# Altium project OrangePi4xProbes.PrjPcb
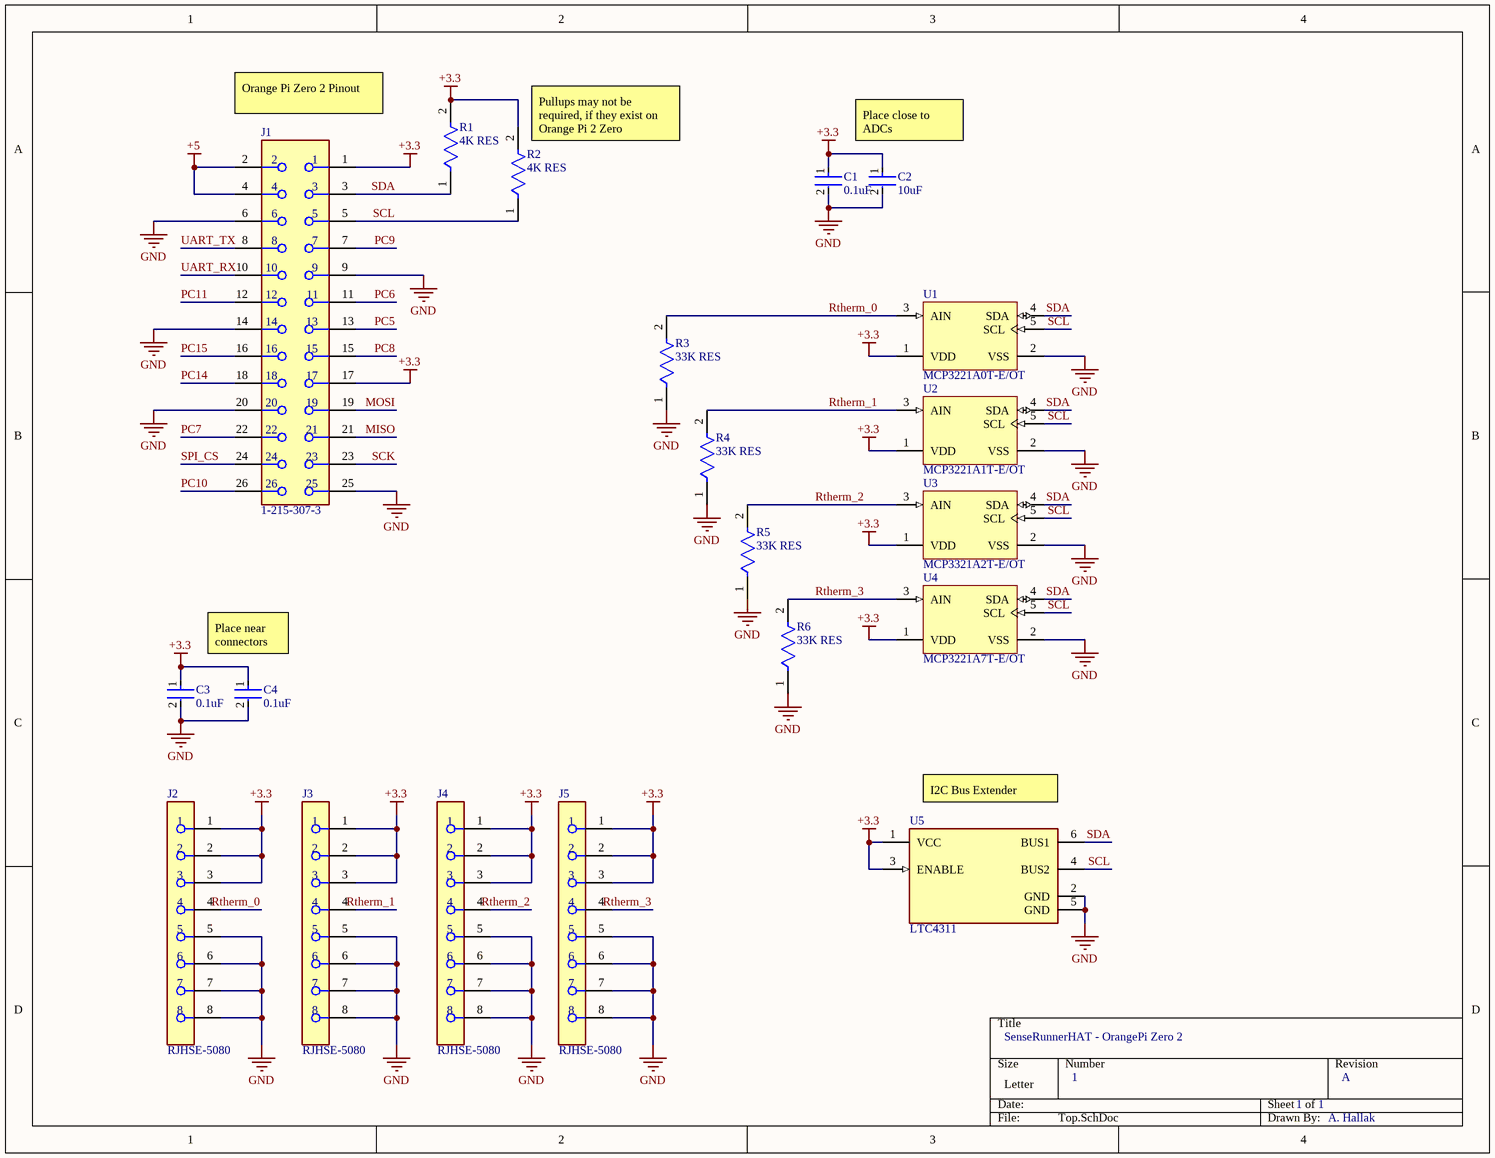
[diagram p0: Top.SchDoc]
1 sheet, 20 parts. Net scope: global (net labels, ports and power ports of the same name join across sheets).
Board file: Hat_Zero2SenseRunner.PcbDoc

## Sheet Top.SchDoc: SenseRunnerHat-OP
size Letter; Author: A. Hallak; SheetNumber: 1; SheetTotal: 1

### Parts
C1  0.1uF  [FP-DE6_D7_T7_F7_5_d0_6-0-MFG]
C2  10uF  [FP-DE6_D7_T7_F7_5_d0_6-0-MFG]
C3  0.1uF  [FP-DE6_D7_T7_F7_5_d0_6-0-MFG]
C4  0.1uF  [FP-DE6_D7_T7_F7_5_d0_6-0-MFG]
J1  1-215-307-3  [26PIN]
J2  RJHSE-5080  [FP-RJHSE-5080-MFG]
J3  RJHSE-5080  [FP-RJHSE-5080-MFG]
J4  RJHSE-5080  [FP-RJHSE-5080-MFG]
J5  RJHSE-5080  [FP-RJHSE-5080-MFG]
R1  4K RES  [FP-H8-MFG]
R2  4K RES  [FP-H8-MFG]
R3  33K RES  [FP-H8-MFG]
R4  33K RES  [FP-H8-MFG]
R5  33K RES  [FP-H8-MFG]
R6  33K RES  [FP-H8-MFG]
U1  MCP3221A0T-E/OT  [SOT-23-OT5_N]
U2  MCP3221A1T-E/OT  [SOT-23-OT5_N]
U3  MCP3321A2T-E/OT  [SOT-23-OT5_N]
U4  MCP3221A7T-E/OT  [SOT-23-OT5_N]
U5  LTC4311  [FP-SC6-6-05-08-1638-IPC_C]

### Nets
+3.3: C1.1 C2.1 C3.1 C4.1 J1.1 J1.17 J2.1 J2.2 J2.3 J3.1 J3.2 J3.3 J4.1 J4.2 J4.3 J5.1 J5.2 J5.3 R1.2 R2.2 U1.1(VDD) U2.1(VDD) U3.1(VDD) U4.1(VDD) U5.1(VCC) U5.3(ENABLE)
+5: J1.2 J1.4
GND: C1.2 C2.2 C3.2 C4.2 J1.6 J1.9 J1.14 J1.20 J1.25 J2.5 J2.6 J2.7 J2.8 J3.5 J3.6 J3.7 J3.8 J4.5 J4.6 J4.7 J4.8 J5.5 J5.6 J5.7 J5.8 R3.1 R4.1 R5.1 R6.1 U1.2(VSS) U2.2(VSS) U3.2(VSS) U4.2(VSS) U5.2(GND) U5.5(GND)
MISO: J1.21
MOSI: J1.19
PC5: J1.13
PC6: J1.11
PC7: J1.22
PC8: J1.15
PC9: J1.7
PC10: J1.26
PC11: J1.12
PC14: J1.18
PC15: J1.16
Rtherm_0: J2.4 R3.2 U1.3(AIN)
Rtherm_1: J3.4 R4.2 U2.3(AIN)
Rtherm_2: J4.4 R5.2 U3.3(AIN)
Rtherm_3: J5.4 R6.2 U4.3(AIN)
SCK: J1.23
SCL: J1.5 R2.1 U1.5(SCL) U2.5(SCL) U3.5(SCL) U4.5(SCL) U5.4(BUS2)
SDA: J1.3 R1.1 U1.4(SDA) U2.4(SDA) U3.4(SDA) U4.4(SDA) U5.6(BUS1)
SPI_CS: J1.24
UART_RX: J1.10
UART_TX: J1.8

### Notes on the sheet
- Orange Pi Zero 2 Pinout
- (near R2) Pullups may not be required, if they exist on Orange Pi 2 Zero
- Place close to ADCs
- Place near connectors
- (near U5) I2C Bus Extender
- SenseRunnerHAT - OrangePi Zero 2
- 1
- A
- A. Hallak

### Library data of the parts
C1 C3 C4 = CMP-06035-062244-1: CAP CER 0.1uF; Part Number: ANY 0.1uF CAP; Lead/Base Style: Formed Leads; Material: Ceramic; Tolerance: 20%; Lead Diameter: 0.6mm; Voltage Rating (AC): 300V; Termination: Radial; Width: 7mm; Package Quantity: 700; Lead Pitch: 7.5mm; Capacitance: 0.1uF; Case/Package: Radial; Resistor Type: Ceramic; Ratings: AEC-Q200; Series: KJ; Depth: 7mm; Min Operating Temperature: -25°C; Height - Seated (Max): 0.394inch; Mount: Through Hole; REACH SVHC: No SVHC; Max Operating Temperature: 125°C; Packaging: Bulk
C2 = CMP-06035-062244-1: CAP CER 10uF; Part Number: ANY 10uF CAP; Lead/Base Style: Formed Leads; Material: Ceramic; Tolerance: 20%; Lead Diameter: 0.6mm; Voltage Rating (AC): 300V; Termination: Radial; Width: 7mm; Package Quantity: 700; Lead Pitch: 7.5mm; Capacitance: 10uF; Case/Package: Radial; Resistor Type: Ceramic; Ratings: AEC-Q200; Series: KJ; Depth: 7mm; Min Operating Temperature: -25°C; Height - Seated (Max): 0.394inch; Mount: Through Hole; REACH SVHC: No SVHC; Max Operating Temperature: 125°C; Packaging: Bulk
J1 = CMP-25680-000025-1: CONN HDR 26POS; Pitch: 0.1inch; Number of Positions: 40; Connector Type: Header; Color: Black; Mount: Through Hole; Number of Rows: 2; Contact Plating: Gold; Packaging: Tray; Row Spacing: 0.1inch; Termination: Solder; Package Quantity: 1; Lead Free: Lead Free
J2-J5 = CMP-02366-000003-1: CONN MOD JACK 8P8C R/A UNSHLD; Manufacturer: Amphenol; Current Rating: 1.5A; Voltage Rating: 125V; Pitch: 1.02mm; Conn Orientation: Right Angle; Number Of Contacts: 8; Is Female: yes; Conn Gender: Female; Part Number: RJHSE-5080; Device Class L3: unset; Footprint Url: https://cdn.amphenol-icc.com/media/wysiwyg/files/drawing/rjhse5080.pdf?__cf_chl_jschl_tk__=e349db0bbbb6188a39347cd5e541b92fa02c9719-1587748343-0-AW7tChdeHzRPLX9gSWj7WrKaXQoY9BsmT9Ek0h-T62M9y3Rs9iypFcOtkzb-6sGYQEjFE-jcoNciDETCOZrh1rYyOesac5SvYLoLwHIsHvF4AKBlx-MXmfZUVk9OTTJLqyQq2qMm0PFRLJpNcK0nrKResqOniRSYixG2sPTmOPraH-ULJFBDL602CHqcI9KKBgTq90Jh1OL2Td4moJ99rFsJRJ1Tk_uoxGe8ublcP_ARu-uLpWcQrBcwOcHDTAwL29DAwVaqcH7ta8Ks7WMlHmVl_pILeEDwT0bE9vu5Pa5S3PtNRF1leuFkgi_FMbUxTDulc5xzbXSfng8srUIV1lWXny5nx1fZJEUa_w97yKjffzBMxiWLWVN-V7-uqAaPbyv_m-wRyw5O25OZNyJOeGU; ComponentLink2URL: https://cdn.amphenol-icc.com/media/wysiwyg/files/documentation/datasheet/inputoutput/io-modjack-rjhse.pdf; Device Class L1: Connectors; Package: CONN_MOD_JACK; Mouser Description: Modular Connectors / Ethernet Connectors R/A RJ45 NONSHIELDED 8 CONT NO LEDS; Manufacturer Part Number: RJHSE-5080; Octopart: https://octopart.com/rjhse-5080-amphenol-45060; Category: Conn; Height: 0.535inch; Temperature: -55°C to +85°C; Digikey Description: CONN MOD JACK 8P8C R/A UNSHLD; Device Class L2: Modular / Ethernet Connectors; Contact Material: Gold,Nickel; ComponentLink2Description: Datasheet; Temperature Range Low: -55°C; RoHS: TRUE; Automotive: No; Temperature Range High: +85°C
R1 R2 = CMP-03212-000005-1: RES 4K; Part Number: ANY 4K RESISTOR; Lead/Base Style: Axial; Lead Diameter: 0.6mm; Resistance Tolerance: 0.1%; Lead Length: 30mm; Number of Resistors: 1; Power Rating: 250mW; Voltage Rating (DC): 350V; Temperature Coefficient: 15ppm/°C; Series: Holco, Holsworthy; Packaging: Bulk; REACH SVHC: No SVHC; Length: 7.2mm; Weight: 0.008466oz; Diameter: 2.5mm; Resistor Type: Thin Film; Package Quantity: 250; Max Operating Temperature: 155°C; Termination: Axial; Number of Terminations: 2; Min Operating Temperature: -55°C; Mount: Axial; ELV: Compliant; RoHS Compliant: Yes; Case/Package: Axial; Max Power Dissipation: 250mW; Resistance: 4K; Voltage Rating: 350V; Technology: METAL FILM
R3-R6 = CMP-03212-000005-1: RES 33K; Part Number: ANY RES - RSET; Lead/Base Style: Axial; Lead Diameter: 0.6mm; Resistance Tolerance: 0.1%; Lead Length: 30mm; Number of Resistors: 1; Power Rating: 250mW; Voltage Rating (DC): 350V; Temperature Coefficient: 15ppm/°C; Series: Holco, Holsworthy; Packaging: Bulk; REACH SVHC: No SVHC; Length: 7.2mm; Weight: 0.008466oz; Diameter: 2.5mm; Resistor Type: Thin Film; Package Quantity: 250; Max Operating Temperature: 155°C; Termination: Axial; Number of Terminations: 2; Min Operating Temperature: -55°C; Mount: Axial; ELV: Compliant; RoHS Compliant: Yes; Case/Package: Axial; Max Power Dissipation: 250mW; Resistance: 33K; Voltage Rating: 350V; Technology: METAL FILM
U1-U3 = CMP-0188-00714-2: Low Power 12-Bit A/D Converter With I2C Interface, 5-Pin SOT-23, Extended Temperature, Tape and Reel; PackageVersion: revBB, Aug-2009; ComponentLink1URL: http://www.microchip.com/; ComponentLink1Description: Manufacturer URL; RevisionNote: URLs added.; ComponentLink3URL: http://www.microchip.com/stellent/groups/techpub_sg/documents/packagingspec/en012702.pdf; ComponentLink2Description: Datasheet; ComponentLink3Description: Package Specification; PackageReference: SOT-23-OT5; PackageDescription: 5-Lead Plastic Small Outline Transistor (OT) [SOT-23]; ComponentLink2URL: http://ww1.microchip.com/downloads/en/DeviceDoc/21732c.pdf; Code_IPC: SOT23-5
  U1: DatasheetVersion: MCP3321A0T-E/OT
  U2: DatasheetVersion: MCP3321A1T-E/OT
  U3: DatasheetVersion: MCP3321A2T-E/OT
U4 = CMP-0188-00714-2: Low Power 12-Bit A/D Converter With I2C Interface, 5-Pin SOT-23, Extended Temperature, Tape and Reel; Part Number: MCP3321A7T-E/OT; PackageVersion: revBB, Aug-2009; ComponentLink1URL: http://www.microchip.com/; ComponentLink1Description: Manufacturer URL; RevisionNote: URLs added.; ComponentLink3URL: http://www.microchip.com/stellent/groups/techpub_sg/documents/packagingspec/en012702.pdf; ComponentLink2Description: Datasheet; ComponentLink3Description: Package Specification; PackageReference: SOT-23-OT5; PackageDescription: 5-Lead Plastic Small Outline Transistor (OT) [SOT-23]; ComponentLink2URL: http://ww1.microchip.com/downloads/en/DeviceDoc/21732c.pdf; Code_IPC: SOT23-5
U5 = CMP-09093-000080-1: IC ACCELERATOR I2C 1CH SC70-6; Operating Supply Current: 300uA; Number of Pins: 70; Package Quantity: 1; Part Number: LTC4311; Packaging: Tape and Reel; Radiation Hardening: No; Max Operating Temperature: 70°C; Series: -; Case/Package: SC; Min Operating Temperature: 0°C; Mount: Surface Mount; Lead Free: Lead Free